# Altium schematic sheet 9.RGB&TOUCH.SchDoc
size A4
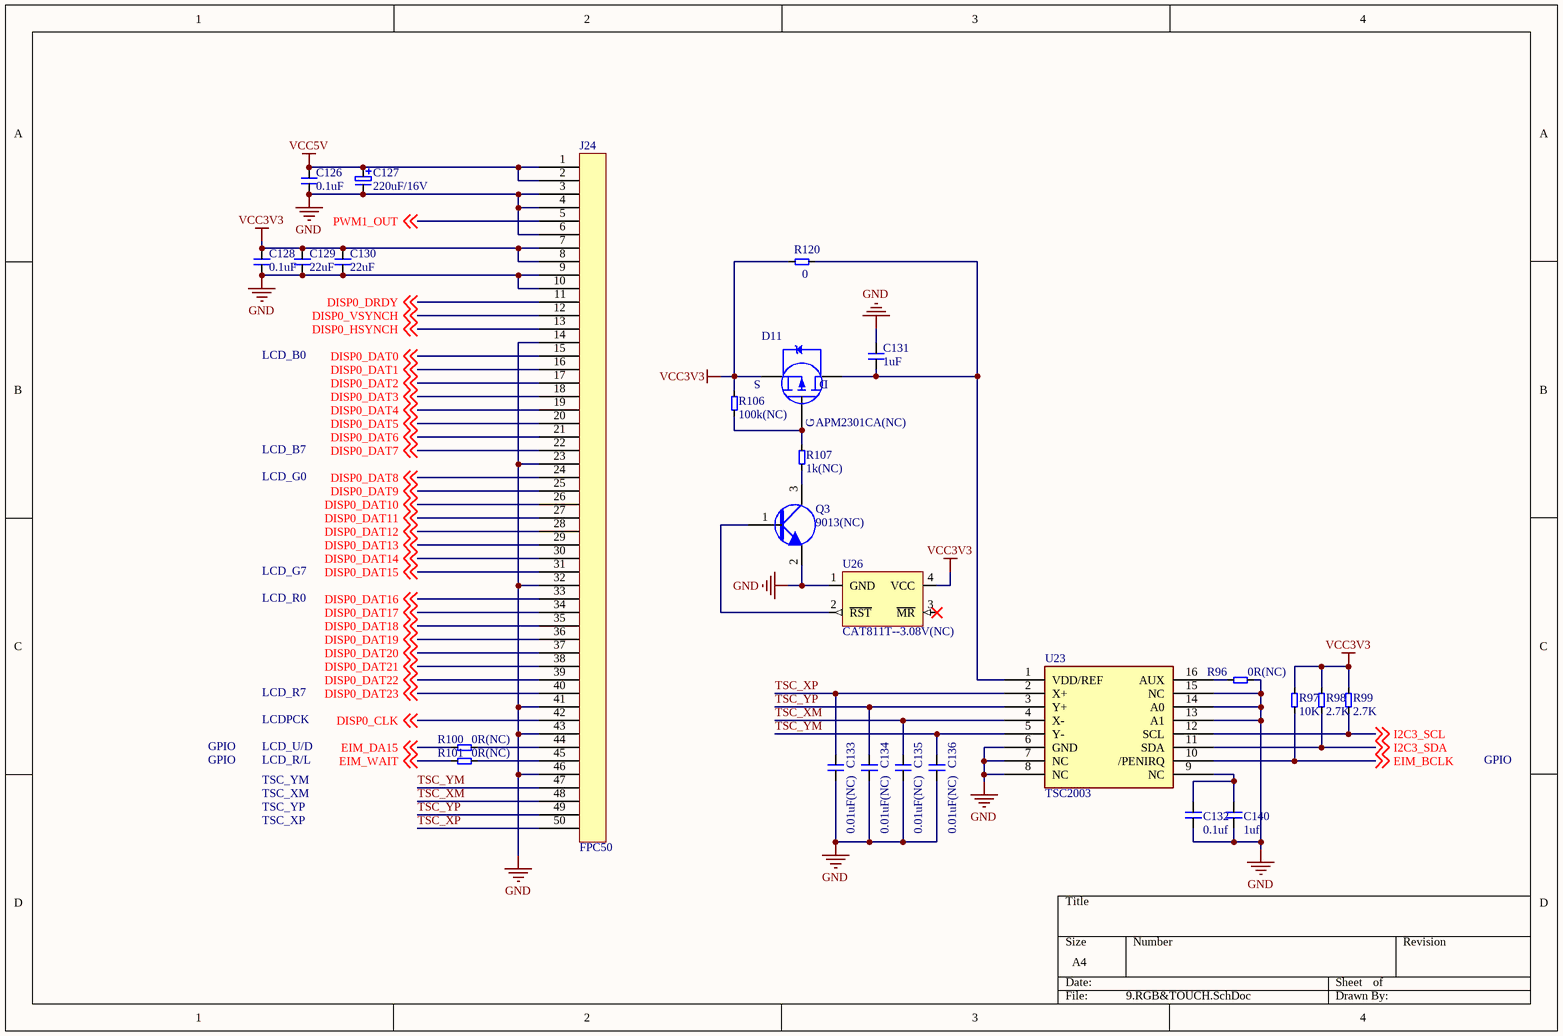
[diagram p0: 9.RGB&TOUCH.SchDoc]

## Parts
C126  0.1uF  [0603C]
C127  220uF/16V  [RAD-3/6]
C128  0.1uF  [0603C]
C129  22uF  [0805C]
C130  22uF  [0805C]
C131  1uF  [0603C]
C132  0.1uf  [0603C]
C133  0.01uF(NC)  [0603C]
C134  0.01uF(NC)  [0603C]
C135  0.01uF(NC)  [0603C]
C136  0.01uF(NC)  [0603C]
C140  1uf  [0603C]
D11  APM2301CA(NC)  [SOT-23]
J24  FPC50  [FPC50-0.5-UP]
Q3  9013(NC)  [SOT-23]
R96  0R(NC)  [0603R]
R97  10K  [0603R]
R98  2.7K  [0603R]
R99  2.7K  [0603R]
R100  0R(NC)  [0603R]
R101  0R(NC)  [0603R]
R106  100k(NC)  [0603R]
R107  1k(NC)  [0603R]
R120  0  [0603R]
U23  TSC2003  [TSSOP16-PW]
U26  CAT811T--3.08V(NC)  [SOT143-4]

## Nets
GND: C126.2 C127.2 C128.2 C129.1 C130.1 C131.1 C132.2 C133.2 C134.2 C135.2 C136.2 C140.2 J24.3 J24.4 J24.6 J24.9 J24.10 J24.14 J24.23 J24.32 J24.41 J24.43 J24.46 Q3.2 R96.1 U23.6(GND) U23.7(NC) U23.8(NC) U23.13(A1) U23.14(A0) U23.15(NC) U26.1(GND)
VCC3V3: C128.1 C129.2 C130.2 D11.2 J24.7 J24.8 R97.1 R98.1 R99.1 R106.2 R120.1 U26.4(VCC)
VCC5V: C126.1 C127.1 J24.1 J24.2
DISP0_CLK: J24.42 ; off-sheet DISP0_CLK
DISP0_DAT0: J24.15 ; off-sheet DISP0_DAT0
DISP0_DAT1: J24.16 ; off-sheet DISP0_DAT1
DISP0_DAT2: J24.17 ; off-sheet DISP0_DAT2
DISP0_DAT3: J24.18 ; off-sheet DISP0_DAT3
DISP0_DAT4: J24.19 ; off-sheet DISP0_DAT4
DISP0_DAT5: J24.20 ; off-sheet DISP0_DAT5
DISP0_DAT6: J24.21 ; off-sheet DISP0_DAT6
DISP0_DAT7: J24.22 ; off-sheet DISP0_DAT7
DISP0_DAT8: J24.24 ; off-sheet DISP0_DAT8
DISP0_DAT9: J24.25 ; off-sheet DISP0_DAT9
DISP0_DAT10: J24.26 ; off-sheet DISP0_DAT10
DISP0_DAT11: J24.27 ; off-sheet DISP0_DAT11
DISP0_DAT12: J24.28 ; off-sheet DISP0_DAT12
DISP0_DAT13: J24.29 ; off-sheet DISP0_DAT13
DISP0_DAT14: J24.30 ; off-sheet DISP0_DAT14
DISP0_DAT15: J24.31 ; off-sheet DISP0_DAT15
DISP0_DAT16: J24.33 ; off-sheet DISP0_DAT16
DISP0_DAT17: J24.34 ; off-sheet DISP0_DAT17
DISP0_DAT18: J24.35 ; off-sheet DISP0_DAT18
DISP0_DAT19: J24.36 ; off-sheet DISP0_DAT19
DISP0_DAT20: J24.37 ; off-sheet DISP0_DAT20
DISP0_DAT21: J24.38 ; off-sheet DISP0_DAT21
DISP0_DAT22: J24.39 ; off-sheet DISP0_DAT22
DISP0_DAT23: J24.40 ; off-sheet DISP0_DAT23
DISP0_DRDY: J24.11 ; off-sheet DISP0_DRDY
DISP0_HSYNCH: J24.13 ; off-sheet DISP0_HSYNCH
DISP0_VSYNCH: J24.12 ; off-sheet DISP0_VSYNCH
EIM_BCLK: R97.2 U23.10(/PENIRQ) ; off-sheet EIM_BCLK
EIM_DA15: R100.2 ; off-sheet EIM_DA15
EIM_WAIT: R101.2 ; off-sheet EIM_WAIT
I2C3_SCL: R99.2 U23.12(SCL) ; off-sheet I2C3_SCL
I2C3_SDA: R98.2 U23.11(SDA) ; off-sheet I2C3_SDA
PWM1_OUT: J24.5 ; off-sheet PWM1_OUT
TSC_XM: C135.1 J24.48 U23.4(X-)
TSC_XP: C133.1 J24.50 U23.2(X+)
TSC_YM: C136.1 J24.47 U23.5(Y-)
TSC_YP: C134.1 J24.49 U23.3(Y+)
NetC131_2: C131.2 D11.3 R120.2 U23.1(VDD/REF)
NetC132_1: C132.1 C140.1 U23.9(NC)
NetD11_1: D11.1 R106.1 R107.2
NetJ24_44: J24.44 R100.1
NetJ24_45: J24.45 R101.1
NetQ3_1: Q3.1 U26.2(~{RST})
NetQ3_3: Q3.3 R107.1
NetR96_2: R96.2 U23.16(AUX)

Not connected (* = marked no-connect by the designer): U26 3(~{MR})*

## Notes on the sheet
- LCD_B0
- LCD_B7
- LCD_G0
- LCD_G7
- LCD_R0
- LCD_R7
- GPIO
- LCD_R/L
- LCD_U/D
- LCDPCK
- TSC_YM
- TSC_XM
- TSC_YP
- TSC_XP
- (in symbol APM2301CA) S; D; G

## Library data of the parts
C126 C128-C136 C140 = 电容
C127 = 直插电解电容
D11 = APM2301CA
J24 = FPC50: FPC CONNECTOR
Q3 = 9013
R96-R101 R106 R107 R120 = 电阻
U23 = TSC2007IPW: TSC2007
U26 = CAT811T--3.08V